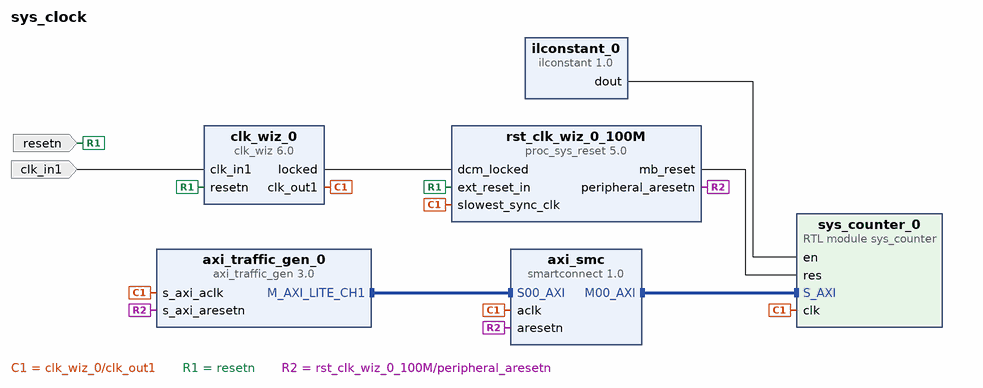
[diagram p0: block diagram of the top level]
# Vivado block design sys_clock, xc7a100tcsg324-1, Vivado 2025.1
create_bd_design sys_clock

create_bd_port -dir I -type clk clk_in1
set_property -dict {CONFIG.FREQ_HZ 100000000} [get_bd_ports clk_in1]
create_bd_port -dir I -type rst resetn

create_bd_cell -type module -reference sys_counter sys_counter_0
create_bd_cell -type ip -vlnv xilinx.com:ip:clk_wiz:6.0 clk_wiz_0
set_property -dict [list \
  CONFIG.CLKOUT1_JITTER 168.856 \
  CONFIG.CLKOUT1_PHASE_ERROR 306.323 \
  CONFIG.CLKOUT1_REQUESTED_OUT_FREQ 464.000 \
  CONFIG.MMCM_CLKFBOUT_MULT_F 58.000 \
  CONFIG.MMCM_CLKOUT0_DIVIDE_F 2.500 \
  CONFIG.MMCM_DIVCLK_DIVIDE 5 \
  CONFIG.RESET_PORT resetn \
  CONFIG.RESET_TYPE ACTIVE_LOW \
] [get_bd_cells clk_wiz_0]
create_bd_cell -type ip -vlnv xilinx.com:ip:axi_traffic_gen:3.0 axi_traffic_gen_0
set_property -dict [list \
  CONFIG.C_ATG_MODE AXI4-Lite \
  CONFIG.C_ATG_SYSINIT_MODES System_Test \
  CONFIG.C_ATG_SYSTEM_INIT_ADDR_MIF address.coe \
  CONFIG.C_ATG_SYSTEM_INIT_CTRL_MIF control.coe \
  CONFIG.C_ATG_SYSTEM_INIT_DATA_MIF data.coe \
  CONFIG.C_ATG_SYSTEM_INIT_MASK_MIF mask.coe \
] [get_bd_cells axi_traffic_gen_0]
create_bd_cell -type ip -vlnv xilinx.com:ip:proc_sys_reset:5.0 rst_clk_wiz_0_100M
set_property -dict {CONFIG.RESET_BOARD_INTERFACE reset CONFIG.USE_BOARD_FLOW true} [get_bd_cells rst_clk_wiz_0_100M]
create_bd_cell -type ip -vlnv xilinx.com:ip:smartconnect:1.0 axi_smc
set_property -dict {CONFIG.NUM_SI 1} [get_bd_cells axi_smc]
create_bd_cell -type inline_hdl -vlnv xilinx.com:inline_hdl:ilconstant:1.0 ilconstant_0

# ---- connections ----

connect_bd_intf_net [get_bd_intf_pins axi_smc/M00_AXI] [get_bd_intf_pins sys_counter_0/S_AXI]
connect_bd_intf_net [get_bd_intf_pins axi_traffic_gen_0/M_AXI_LITE_CH1] [get_bd_intf_pins axi_smc/S00_AXI]
connect_bd_net -net clk_in1_1 [get_bd_ports clk_in1] [get_bd_pins clk_wiz_0/clk_in1]
connect_bd_net [get_bd_pins clk_wiz_0/clk_out1] \
  [get_bd_pins axi_traffic_gen_0/s_axi_aclk] [get_bd_pins axi_smc/aclk] [get_bd_pins rst_clk_wiz_0_100M/slowest_sync_clk] \
  [get_bd_pins sys_counter_0/clk]
connect_bd_net [get_bd_pins clk_wiz_0/locked] [get_bd_pins rst_clk_wiz_0_100M/dcm_locked]
connect_bd_net [get_bd_pins ilconstant_0/dout] [get_bd_pins sys_counter_0/en]
connect_bd_net [get_bd_ports resetn] [get_bd_pins clk_wiz_0/resetn] [get_bd_pins rst_clk_wiz_0_100M/ext_reset_in]
connect_bd_net [get_bd_pins rst_clk_wiz_0_100M/mb_reset] [get_bd_pins sys_counter_0/res]
connect_bd_net [get_bd_pins rst_clk_wiz_0_100M/peripheral_aresetn] [get_bd_pins axi_traffic_gen_0/s_axi_aresetn] [get_bd_pins axi_smc/aresetn]

# ---- address map ----
assign_bd_address -offset 0x00000000 -range 128 -target_address_space [get_bd_addr_spaces axi_traffic_gen_0/Reg1] [get_bd_addr_segs sys_counter_0/S_AXI/reg0]

validate_bd_design
save_bd_design
